# Altium project Atmel ICE Breakout.PrjPcb
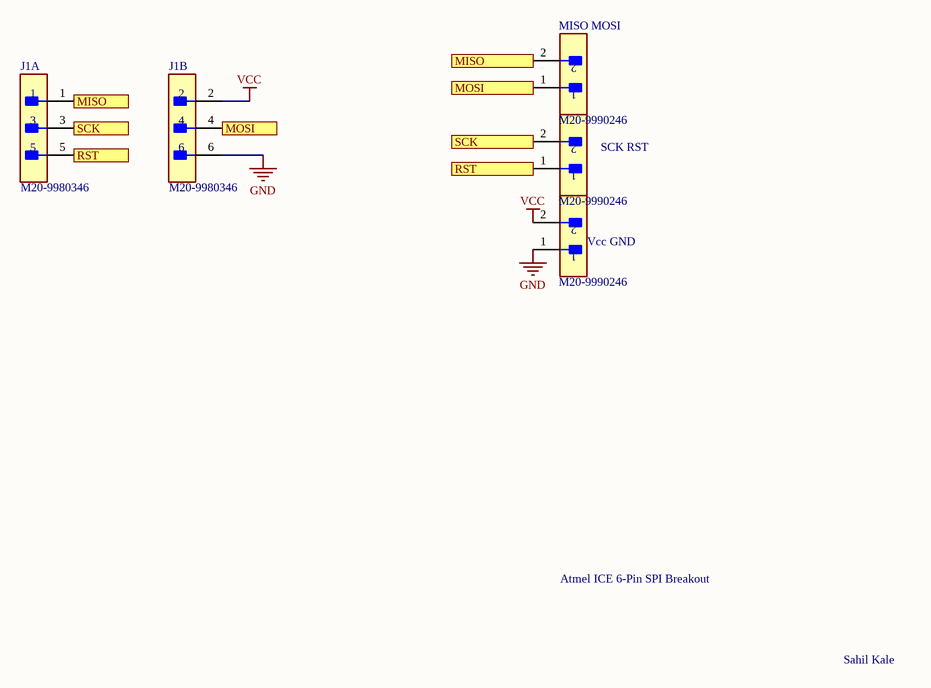
[diagram p0: SCH1.SchDoc]
1 sheet, 4 parts. Net scope: flat (ports and power ports of the same name join across sheets).
Board file: PCB.PcbDoc

## Sheet SCH1.SchDoc
size Letter

### Parts
J1  M20-9980346  [FP-M20-9980346-MFG]  (parts A,B of 2)
MISO_MOSI  M20-9990246  [FP-M20-9990246-MFG]
SCK_RST  M20-9990246  [FP-M20-9990246-MFG]
Vcc_GND  M20-9990246  [FP-M20-9990246-MFG]

### Ports
MISO, MOSI, RST, SCK

### Nets
GND: J1.6 Vcc_GND.1
VCC: J1.2 Vcc_GND.2
NetJ1_1: J1.1 MISO_MOSI.2 ; port MISO
NetJ1_3: J1.3 SCK_RST.2 ; port SCK
NetJ1_4: J1.4 MISO_MOSI.1 ; port MOSI
NetJ1_5: J1.5 SCK_RST.1 ; port RST

### Notes on the sheet
- Atmel ICE 6-Pin SPI Breakout
- Sahil Kale

### Library data of the parts
J1 = CMP-2000-06636-2: CONN HEADER VERT 6POS 2.54MM; Manufacturer: Harwin; Current Rating: 3A; Number Of Contacts: 6; Conn Gender: Male; Description: 2.54mm Pitch 6 Way 2 Row Straight PCB Header, Solder Termination, 3A; Conn Orientation: Vertical; Device Class L1: Connectors; ComponentLink2Description: Datasheet; Height: 8.99mm; Temperature Range High: +105°C; Contact Material: Tin,Nickel; RoHS: TRUE; Temperature Range Low: -40°C; ComponentLink2URL: https://cdn.harwin.com/pdfs/M20-998.pdf; Digikey Description: CONN HEADER VERT 6POS 2.54MM; Pitch: 2.54mm; Package: M20-9980346; Device Class L2: Headers and Wire Housings; Manufacturer Part Number: M20-9980346; Number Of Rows: 2; Category: Conn; Lead Free: Yes; Mouser Description: 2.54mm (0.1") Pitch DIL Vertical PC Tail Pin Header, 6.1mm mating pin height, tin, 3+3 contacts; Temperature: -40°C to +105°C; Device Class L3: unset; Octopart: https://octopart.com/m20-9980346-harwin-5436545; Automotive: No
MISO_MOSI SCK_RST Vcc_GND = CMP-15831-000009-1: CONN HEADER VERT 2POS 2.54MM; Manufacturer: Harwin; Conn Gender: Male; Conn Orientation: Vertical; Number Of Contacts: 2; Current Rating: 3A; ComponentLink2URL: https://cdn.harwin.com/pdfs/M20-999.pdf; ComponentLink2Description: Datasheet; Package: M20-9990246; Temperature: -40°C to +105°C; Octopart: https://octopart.com/m20-9990246-harwin-2590635; Mouser Description: 2.54mm (0.1") Pitch SIL Vertical PC Tail Pin Header, 6.1mm mating pin height, tin, 2 contacts; Temperature Range High: +105°C; Device Class L1: Connectors; RoHS: TRUE; Automotive: No; Height: 8.99mm; Number Of Rows: 1; Contact Material: Tin,Nickel; Category: Conn; Pitch: 2.54mm; Lead Free: Yes; Digikey Description: CONN HEADER VERT 2POS 2.54MM; Manufacturer Part Number: M20-9990246; Temperature Range Low: -40°C; Device Class L3: unset; Device Class L2: Headers and Wire Housings